# EAGLE design talpican (EAGLE 5.12)
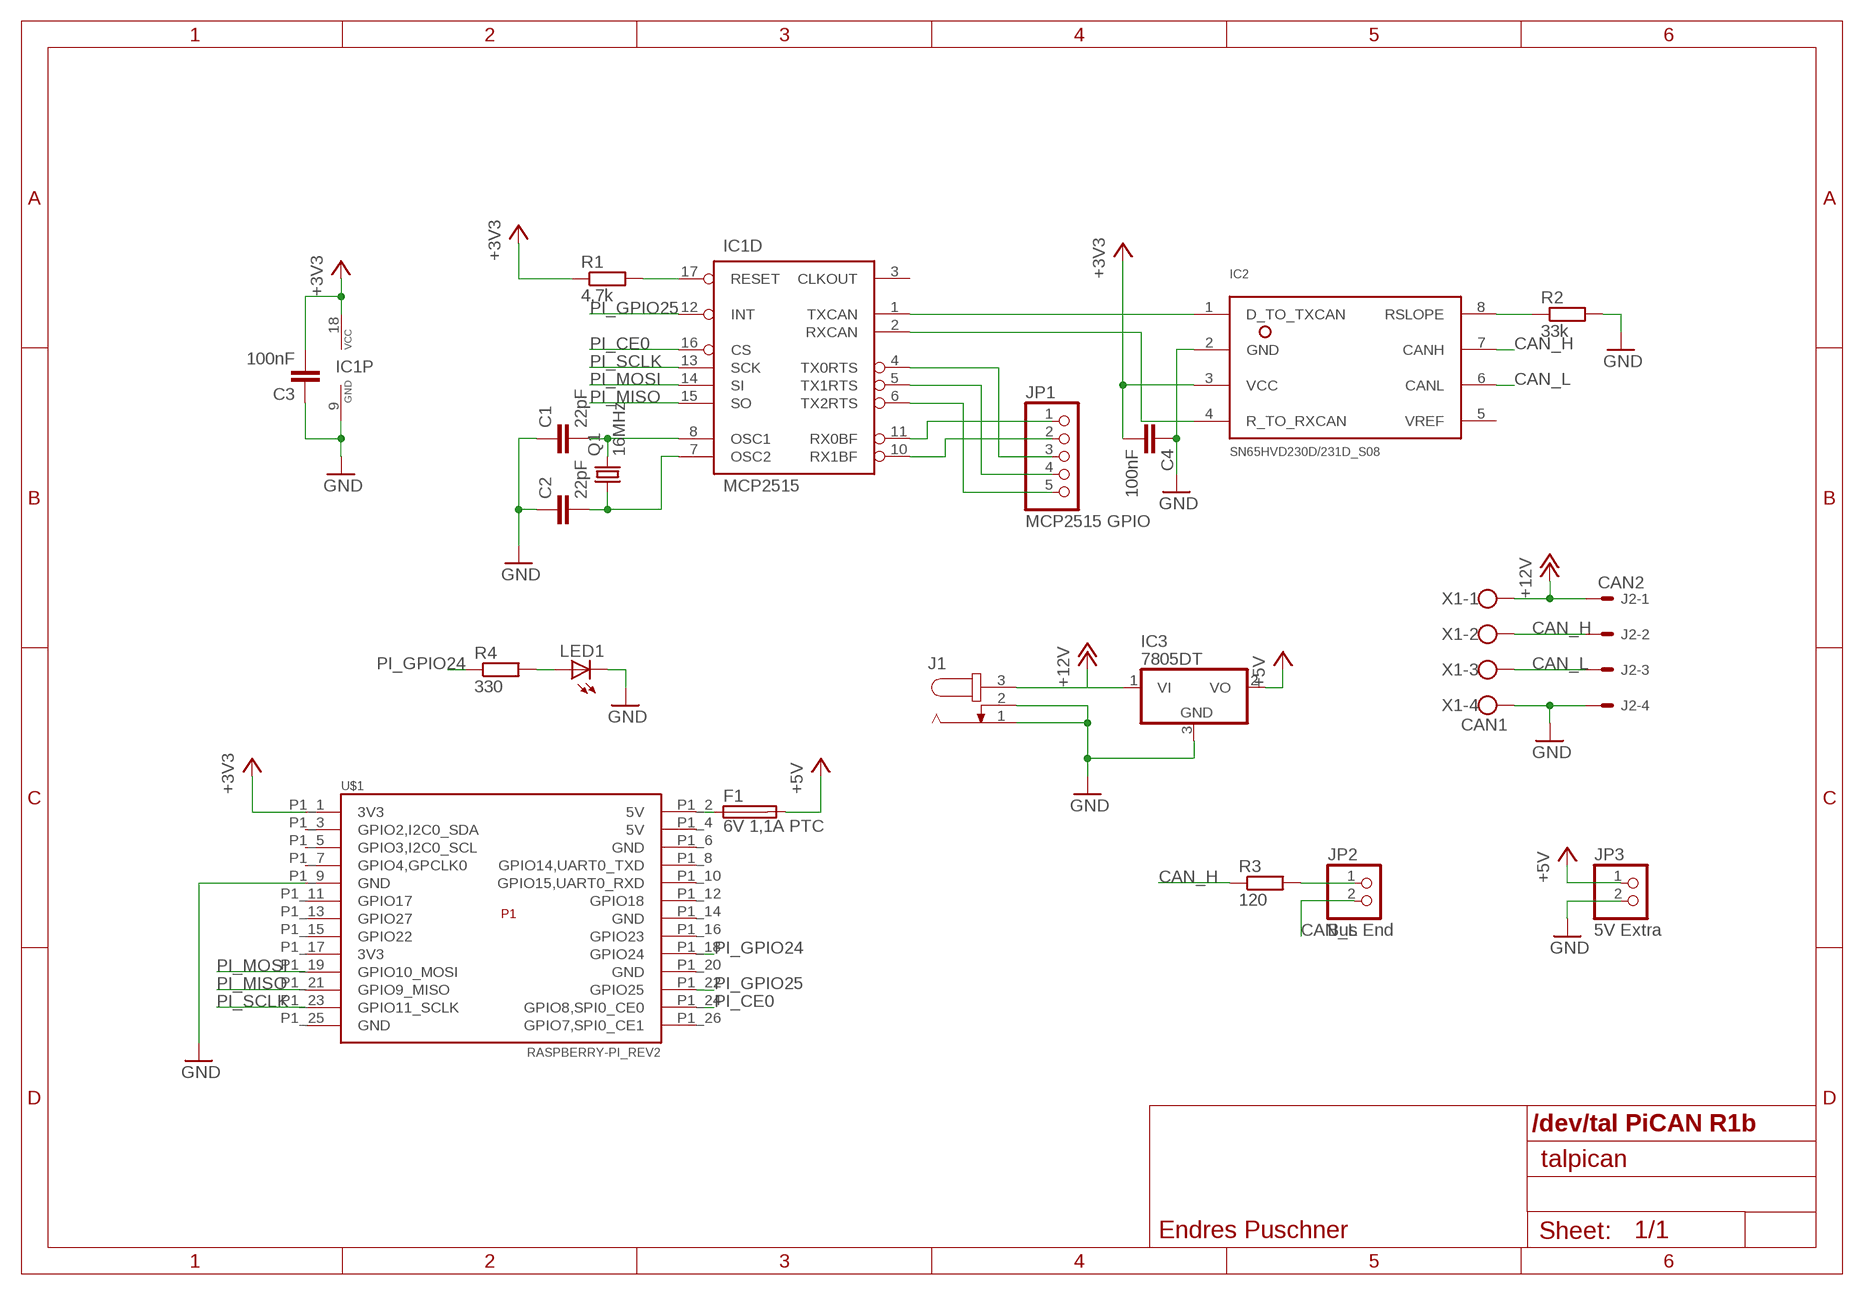
[diagram p0: schematic, sheet 1]

## Parts
C1  22pF  C-EUC0603  [C0603]
C2  22pF  C-EUC0603  [C0603]
C3  100nF  C-EUC0603  [C0603]
C4  100nF  C-EUC0603  [C0603]
F1  6V 1,1A PTC  FUSE1812  [C1812]
IC1  MCP2515  MCP2515SO  [SO-18W]
IC2  SN65HVD230D/231D_S08  [SO08]
IC3  7805DT  [TO252]
J1  JACK-PLUG1  [SPC4078]
J2  CAN2  22-27-2041-04  [6410-04]
JP1  MCP2515 GPIO  PINHD-1X5  [1X05]
JP2  Bus End  PINHD-1X2  [1X02]
JP3  5V Extra  PINHD-1X2  [1X02]
LED1  LEDSML1206  [SML1206]
Q1  16MHz  CRYSTALHC49UP  [HC49UP]
R1  4,7k  R-EU_R0603  [R0603]
R2  33k  R-EU_R0603  [R0603]
R3  120  R-EU_R0603  [R0603]
R4  330  R-EU_R0603  [R0603]
U$1  RASPBERRY-PI_REV2  [RASPBERRY-PI_REV2]
X1  CAN1  AKL059-04  [RIA059-04]

## Nets
+3V3: C3.2 C4.2 IC1.18(P:VCC) IC2.3(VCC) R1.1 U$1.P1_1(3V3)
+5V: F1.2 IC3.2(VO) JP3.1
+12V: IC3.1(VI) J1.3 J2.1 X1.1
CAN_H: IC2.7(CANH) J2.2 R3.1 X1.2
CAN_L: IC2.6(CANL) J2.3 JP2.2 X1.3
GND: C1.1 C2.1 C3.1 C4.1 IC1.9(P:GND) IC2.2(GND) IC3.3(GND) J1.1 J1.2 J2.4 JP3.2 LED1.C R2.2 U$1.P1_9(GND) X1.4
N$1: C1.2 IC1.8(D:OSC1) Q1.2
N$2: C2.2 IC1.7(D:OSC2) Q1.1
N$3: IC2.8(RSLOPE) R2.1
N$4: IC1.17(D:RESET) R1.2
N$6: IC1.1(D:TXCAN) IC2.1(D_TO_TXCAN)
N$7: IC1.2(D:RXCAN) IC2.4(R_TO_RXCAN)
N$8: IC1.11(D:RX0BF) JP1.1
N$9: IC1.10(D:RX1BF) JP1.2
N$10: IC1.4(D:TX0RTS) JP1.3
N$11: IC1.5(D:TX1RTS) JP1.4
N$12: IC1.6(D:TX2RTS) JP1.5
N$13: F1.1 U$1.P1_2(5V)
N$14: JP2.1 R3.2
N$15: LED1.A R4.2
PI_CE0: IC1.16(D:CS) U$1.P1_24(GPIO8,SPI0_CE0)
PI_GPIO24: R4.1 U$1.P1_18(GPIO24)
PI_GPIO25: IC1.12(D:INT) U$1.P1_22(GPIO25)
PI_MISO: IC1.15(D:SO) U$1.P1_21(GPIO9_MISO)
PI_MOSI: IC1.14(D:SI) U$1.P1_19(GPIO10_MOSI)
PI_SCLK: IC1.13(D:SCK) U$1.P1_23(GPIO11_SCLK)
Unconnected: IC1.3(D:CLKOUT) IC2.5(VREF) U$1.P1_3(GPIO2,I2C0_SDA) U$1.P1_4(5V) U$1.P1_5(GPIO3,I2C0_SCL) U$1.P1_6(GND) U$1.P1_7(GPIO4,GPCLK0) U$1.P1_8(GPIO14,UART0_TXD) U$1.P1_10(GPIO15,UART0_RXD) U$1.P1_11(GPIO17) U$1.P1_12(GPIO18) U$1.P1_13(GPIO27) U$1.P1_14(GND) U$1.P1_15(GPIO22) U$1.P1_16(GPIO23) U$1.P1_17(3V3) U$1.P1_20(GND) U$1.P1_25(GND) U$1.P1_26(GPIO7,SPI0_CE1)

## Notes on the sheet
- /dev/tal PiCAN R1b
- Endres Puschner

## Library data of the parts
C1-C4 = resistor:C-EU: CAPACITOR, European symbol
F1 = fuse-ep:FUSE: Fuse
IC1 = can:MCP2515: MC2515 Stand-Alone CAN Controller With SPI Interface, Microchip
IC2 = can:SN65HVD230D/231D_: SN65HVD230D SN65HVD231D CAN Driver
IC3 = linear:78*: Positive VOLTAGE REGULATOR Source: http://cache.national.com/ds/LM/LM78L05.pdf http://www.fairchildsemi.com/ds/LM/LM7805.pdf
J1 = con-jack:JACK-PLUG: DC POWER JACK Power Jack, DC, Right Angle, Through Hole, Rated 5A at 16VDC, PC Terminals Distributor: Farnell (www.Farnell.de) Drawing: 84N1161.pdf / 84N1162.pdf Manufacturer: SPC Technology (www.spctechnology.com) Type: SPC4077 / SPC 4078; OC_FARNELL: unknown; OC_NEWARK: unknown
J2 = con-molex:22-?-04: CONNECTOR wire to board 2.54 mm (.1 inch) pitch header; OC_FARNELL: unknown; OC_NEWARK: unknown
JP1 = pinhead:PINHD-1X5: PIN HEADER
JP2 JP3 = pinhead:PINHD-1X2: PIN HEADER
LED1 = led:LED: LED OSRAM: - CHIPLED LG R971, LG N971, LY N971, LG Q971, LY Q971, LO R971, LY R971 LH N974, LH R974 LS Q976, LO Q976, LY Q976 LO Q996 - Hyper CHIPLED LW Q18S LB Q993, LB Q99A, LB R99A - SideLED LS A670, LO A670, LY A670, LG A670, LP A670 LB A673, LV A673, LT A673, LW A673 LH A674 LY A675 LS A676, LA A676, LO A676, LY A676, LW A676 LS A679, LY A679, LG A679 - Hyper Micro SIDELED® LS Y876, LA Y876, LO Y876, LY Y876 LT Y87S - SmartLED LW L88C, LW L88S LB L89C, LB L89S, LG L890 LS L89K, LO L89K, LY L89K LS L896, LA L896, LO L896, LY L896 - TOPLED LS T670, LO T670, LY T670, LG T670, LP T670 LSG T670, LSP T670, LSY T670, LOP T670, LYG T670 LG T671, LOG T671, LSG T671 LB T673, LV T673, LT T673, LW T673 LH T674 LS T676, LA T676, LO T676, LY T676, LB T676, LH T676, LSB T676, LW T676 LB T67C, LV T67C, LT T67C, LS T67K, LO T67K, LY T67K, LW E67C LS E67B, LA E67B, LO E67B, LY E67B, LB E67C, LV E67C, LT E67C LW T67C LS T679, LY T679, LG T679 LS T770, LO T770, LY T770, LG T770, LP T770 LB T773, LV T773, LT T773, LW T773 LH T774 LS E675, LA E675, LY E675, LS T675 LS T776, LA T776, LO T776, LY T776, LB T776 LHGB T686 LT T68C, LB T68C - Hyper Mini TOPLED® LB M676 - Mini TOPLED Santana® LG M470 LS M47K, LO M47K, LY M47K Source: http://www.osram.convergy.de LUXEON: - LUMILED® LXK2-PW12-R00, LXK2-PW12-S00, LXK2-PW14-U00, LXK2-PW14-V00 LXK2-PM12-R00, LXK2-PM12-S00, LXK2-PM14-U00 LXK2-PE12-Q00, LXK2-PE12-R00, LXK2-PE12-S00, LXK2-PE14-T00, LXK2-PE14-U00 LXK2-PB12-K00, LXK2-PB12-L00, LXK2-PB12-M00, LXK2-PB14-N00, LXK2-PB14-P00, LXK2-PB14-Q00 LXK2-PR12-L00, LXK2-PR12-M00, LXK2-PR14-Q00, LXK2-PR14-R00 LXK2-PD12-Q00, LXK2-PD12-R00, LXK2-PD12-S00 LXK2-PH12-R00, LXK2-PH12-S00 LXK2-PL12-P00, LXK2-PL12-Q00, LXK2-PL12-R00 Source: www.luxeon.com KINGBRIGHT: KA-3528ASYC Source: www.kingbright.com
Q1 = crystal:CRYSTAL: CRYSTAL; OC_FARNELL: unknown; OC_NEWARK: unknown
R1-R4 = resistor:R-EU_: RESISTOR, European symbol
U$1 = RaspberryPi_withoutP5:RASPBERRY-PI_REV2: Raspberry Pi Board <http://www.raspberrypi.org/> Jacques Lagnel V1.0 (beta) 2012 Mateusz Bawaj V1.1 (beta) 2012 Board dimension: Forum 3D model <http://www.raspberrypi.org/forum/general-discussion/mechanical-profile-3d-models?value=3d%20model&type=1&include=1&search=1&ret=all> The GPIO Connector (P1): http://elinux.org/RPi_Low-level_peripherals The GPIO Connector (P5): http://www.raspberrypi-spy.co.uk/2012/09/raspberry-pi-p5-header/
X1 = con-reichelt:AKL059-04: Reichelt: AKL 059-04; OC_FARNELL: unknown; OC_NEWARK: unknown

## Board
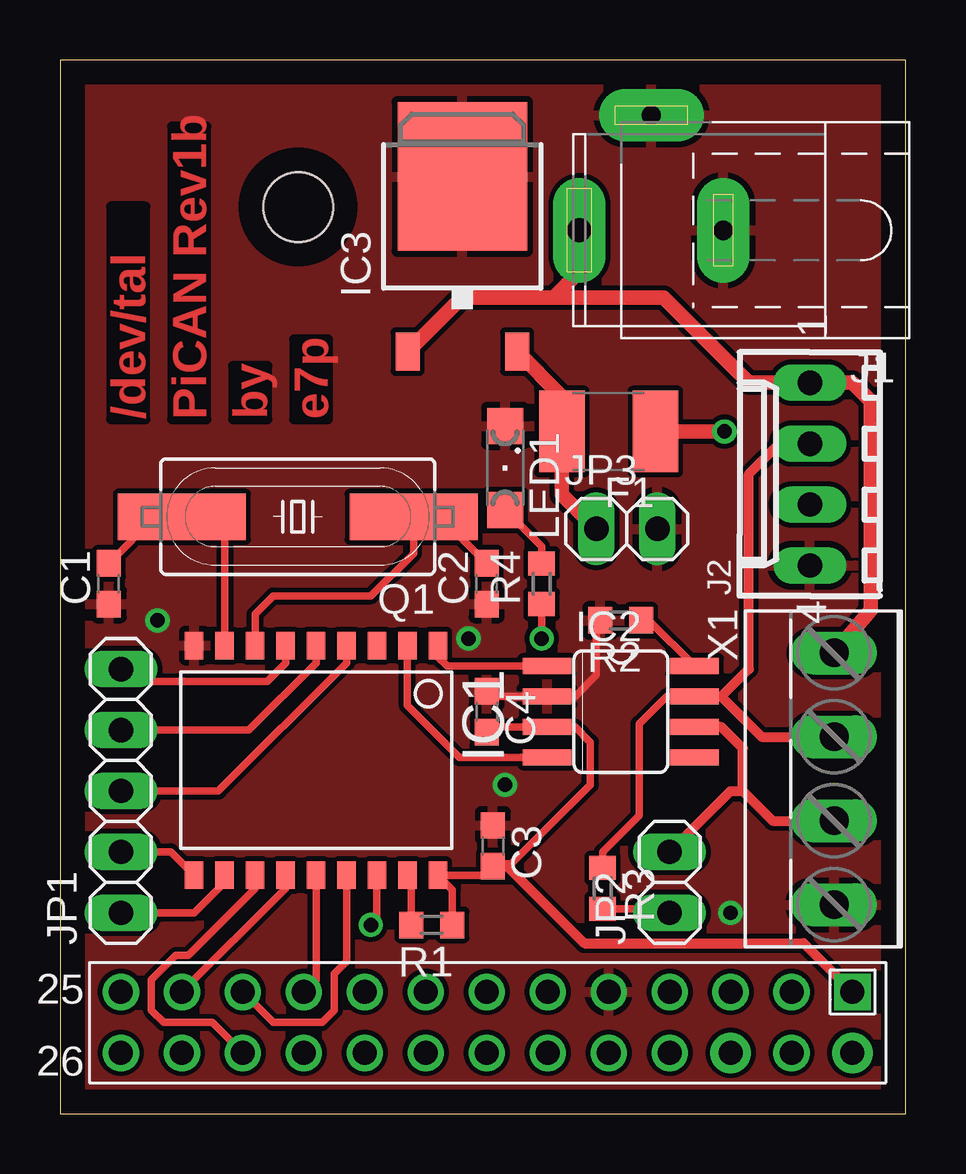
[diagram p1: board, top side]
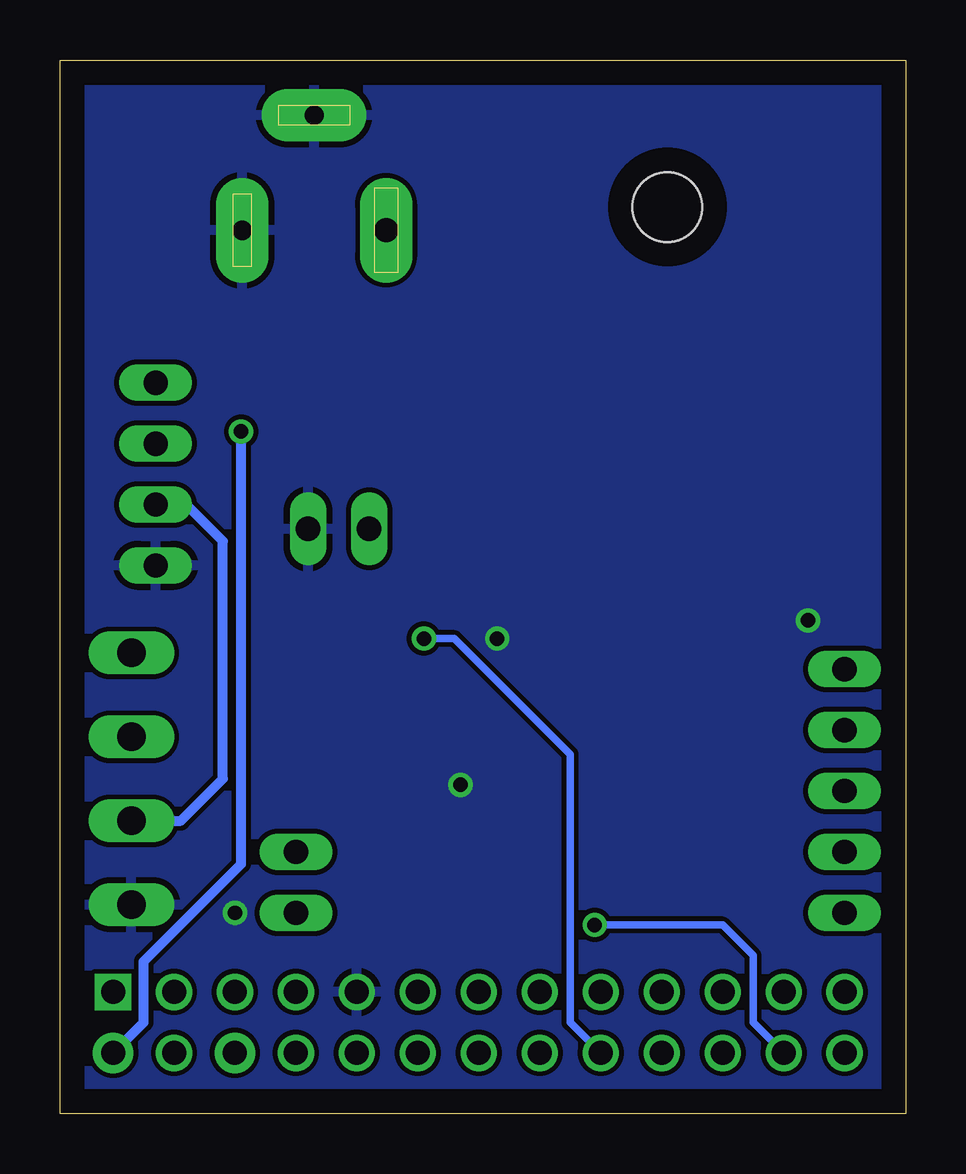
[diagram p2: board, bottom side, seen from below]

Size 35.23 x 43.93 mm. Coordinates in mm from the lower left corner, seen from the top.
Outline: 0,0 35.23,0 35.23,43.93 0,43.93 0,0
Copper layers (1*16): Top 0.035mm / dielectric 1.5mm / Bottom 0.035mm
Design rules "default *": minimum track width 10mil, minimum drill 0.3mm, track to track 8mil, track to pad 8mil, pad to pad 8mil, via to via 8mil, smd to smd 8mil, copper to edge 40mil, drill to drill 8mil, minimum pad ring 10mil, minimum via ring 8mil, stop-mask expansion 4mil, vias tented up to drill 0mil, thermal gap 10mil
tKeepout: area 6.9,34.8 to 13,40.9
bKeepout: area 6.9,34.8 to 13,40.9
vRestrict: area 6.9,34.8 to 13,40.9
Milling: 4 lines

### Footprints (pad centres in the part's own frame; a part is rotated, then mirrored left to right if it is on the bottom)
C0603 = smd 1.1 x 1: 1 -0.85,0; 2 0.85,0
C1812 = smd 1.9 x 3.4: 1 -1.95,0; 2 1.95,0
SO-18W = smd 0.762 x 1.143: 1 -5.08,-4.788; 2 -3.81,-4.788; 3 -2.54,-4.788; 4 -1.27,-4.788; 5 0,-4.788; 6 1.27,-4.788; 7 2.54,-4.788; 8 3.81,-4.788; 9 5.08,-4.788; 10 5.08,4.788; 11 3.81,4.788; 12 2.54,4.788; 13 1.27,4.788; 14 0,4.788; 15 -1.27,4.788; 16 -2.54,4.788; 17 -3.81,4.788; 18 -5.08,4.788
SO08 = smd 0.66 x 2.032: 1 -1.905,-3.073; 2 -0.635,-3.073; 3 0.635,-3.073; 4 1.905,-3.073; 5 1.905,3.073; 6 0.635,3.073; 7 -0.635,3.073; 8 -1.905,3.073
TO252 = smd 1 x 1.6: 1 -2.28,-4.8; 2 2.28,-4.8 | smd 5.4 x 6.2: 3 0,2.5
SPC4078 = drill 0.8 pad 2.184 long: 1 -3,0; 2 0,-4.8 | drill 1 pad 2.184 long: 3 3,0
6410-04 = drill 1.016 long: 1 3.81,0; 2 1.27,0; 3 -1.27,0; 4 -3.81,0
1X05 = drill 1.016 long: 1 -5.08,0; 2 -2.54,0; 3 0,0; 4 2.54,0; 5 5.08,0
1X02 = drill 1.016 long: 1 -1.27,0; 2 1.27,0
SML1206 = smd 1.5 x 1.5: A 1.75,0; C -1.75,0
HC49UP = smd 5.334 x 1.93: 1 -4.826,0; 2 4.826,0
R0603 = smd 1 x 1.1: 1 -0.85,0; 2 0.85,0
RASPBERRY-PI_REV2 = drill 1 square: P1_1 -41.91,21.59 | drill 1 pad 1.676 round: P1_2 -41.91,24.13; P1_6 -36.83,24.13 | drill 1 round: P1_3 -39.37,21.59; P1_4 -39.37,24.13; P1_5 -36.83,21.59; P1_7 -34.29,21.59; P1_8 -34.29,24.13; P1_9 -31.75,21.59; P1_10 -31.75,24.13; P1_11 -29.21,21.59; P1_12 -29.21,24.13; P1_13 -26.67,21.59; P1_14 -26.67,24.13; P1_15 -24.13,21.59; P1_16 -24.13,24.13; P1_17 -21.59,21.59; P1_18 -21.59,24.13; P1_19 -19.05,21.59; P1_20 -19.05,24.13; P1_21 -16.51,21.59; P1_22 -16.51,24.13; P1_23 -13.97,21.59; P1_24 -13.97,24.13; P1_25 -11.43,21.59; P1_26 -11.43,24.13 | hole 2.9: -18.81,-11.135
RIA059-04 = drill 1.194 long: 1 -5.25,-1.27; 2 -1.75,-1.27; 3 1.75,-1.27; 4 5.25,-1.27

### Placement (x,y rotation side)
C1  2.03,22.1 90 top
C2  17.78,22.1 90 top
C3  18.03,11.18 270 top
C4  17.78,16.76 270 top
F1  22.86,28.45 180 top
IC1  10.67,14.73 180 top
IC2  23.37,16.76 270 top
IC3  16.76,36.58 0 top
J1  24.64,36.83 180 top
J2  31.24,26.67 90 top
JP1  2.54,13.46 90 top
JP2  25.4,9.65 90 top
JP3  23.62,24.38 0 top
LED1  18.54,26.92 270 top
Q1  9.91,24.89 180 top
R1  15.49,7.87 180 top
R2  23.37,20.57 180 top
R3  22.61,9.4 270 top
R4  20.07,22.1 90 top
U$1  -8.89,26.67 180 top
X1  33.53,13.97 270 top

### Tracks (layer width: path | path; a pad name or v marks a point on that pad's centre or on a via)
+3V3
  Top 0.305: R1.1 16.34,9.35 IC1.18 17.65,9.94 C3.2 18.12,10.41 18.8,10.41 22.1,13.72 22.1,15.49 21.46,16.13 IC2.3 18,16.13 C4.2
  Top 0.406: U$1.P1_1 30.99,7.11 21.84,7.11 18.63,10.33 C3.2
+5V
  Top 0.61: IC3.2 20.91,29.91 F1.2 20.91,25.83 JP3.1
+12V
  Top 0.61: X1.1 33.78,21 33.78,29.72 33.02,30.48 J2.1 28.7,30.48 25.15,34.04 20.57,34.04 | IC3.1 16.74,34.04 20.57,34.04 | J1.3 21.64,35.1 20.57,34.04
CAN_H
  Top 0.305: R3.1 22.61,10.92 24.13,12.45 24.13,16.26 25.27,17.4 IC2.7
  Top 0.406: IC2.7 27.56,17.4 | 27.56,17.4 29.24,15.72 X1.2 | 27.56,17.4 28.7,18.54 28.7,26.67 29.97,27.94 J2.2
CAN_L
  Top 0.406: 28.45,13.46 28.45,15.24 27.56,16.13 IC2.6 | JP2.2 27.94,13.46 28.45,13.46 | 28.45,13.46 29.69,12.22 X1.3
  Bottom 0.406: J2.3 29.97,25.4 28.45,23.88 28.45,13.97 30.2,12.22 X1.3
GND  (via drill 0.6)
  Top 0.305: C4.1 18,17.4 IC2.2 21.46,17.4 22.35,18.29 22.35,20.41 R2.2
  Top 0.61: J1.2 24.89,41.91 | IC3.3 17.82,39.88
  other vias: 4.06,20.57 18.54,13.72 27.94,8.38 17.02,19.81
  pour Top: 0,0 35.31,0 35.31,43.94 0,43.94
  pour Bottom: 0,0 35.31,0 35.31,43.94 0,43.94
N$1
  Top 0.305: IC1.8 6.86,24.38 6.35,24.89 Q1.2 3.98,24.89 C1.2
N$2
  Top 0.305: IC1.7 8.13,20.83 8.89,21.59 12.95,21.59 14.73,23.37 14.73,24.38 | 14.73,24.38 Q1.1 | C2.2 16.34,24.38 14.73,24.38
N$3
  Top 0.305: IC2.8 24.54,20.57 R2.1
N$4
  Top 0.305: IC1.17 14.64,9.78 R1.2
N$6
  Top 0.305: IC1.1 15.75,19.05 16.13,18.67 IC2.1
N$7
  Top 0.305: IC1.2 14.48,17.02 16.64,14.86 IC2.4
N$8
  Top 0.305: JP1.1 5.59,8.38 6.86,9.65 IC1.11
N$9
  Top 0.305: IC1.10 4.61,10.92 JP1.2
N$10
  Top 0.305: IC1.4 11.94,18.8 6.6,13.46 JP1.3
N$11
  Top 0.305: IC1.5 10.67,18.8 7.87,16 JP1.4
N$12
  Top 0.305: IC1.6 9.4,18.8 8.64,18.03 3.05,18.03 JP1.5
N$13  (via drill 0.6)
  Top 0.61: v27.69,28.45 F1.1
  Bottom 0.406: U$1.P1_2 31.75,3.81 31.75,6.35 27.69,10.41 v27.69,28.45
N$14
  Top 0.305: JP2.1 25.23,8.55 R3.2
N$15
  Top 0.305: R4.2 20.07,23.65 LED1.A
PI_CE0  (via drill 0.6)
  Top 0.305: IC1.16 13.21,8.13 v12.95,7.87
  Bottom 0.305: v12.95,7.87 7.62,7.87 6.35,6.6 6.35,3.81 U$1.P1_24
PI_GPIO24  (via drill 0.6)
  Top 0.305: v20.07,19.81 R4.1
  Bottom 0.305: U$1.P1_18 13.97,3.81 13.97,14.99 18.8,19.81 v20.07,19.81
PI_GPIO25
  Top 0.305: IC1.12 8.13,9.4 5.33,6.6 4.83,6.6 3.81,5.59 3.81,4.32 4.32,3.81 6.35,3.81 U$1.P1_22
PI_MISO
  Top 0.305: IC1.15 11.94,6.35 11.43,5.84 11.43,4.32 10.92,3.81 8.89,3.81 U$1.P1_21
PI_MOSI
  Top 0.305: IC1.14 10.67,5.59 U$1.P1_19
PI_SCLK
  Top 0.305: IC1.13 9.4,9.4 U$1.P1_23

### Text on the board
Top: /dev/tal | PiCAN Rev1b | by | e7p